# EAGLE design mke (EAGLE 5.09)
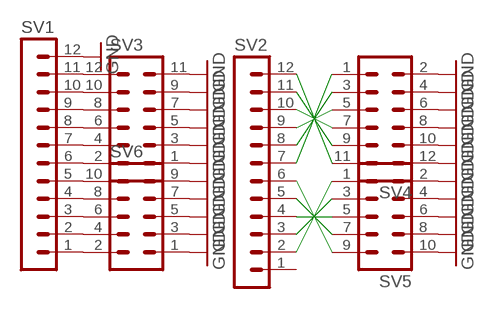
[diagram p0: schematic, sheet 1]

## Parts
SV1  MA12-1  [MA12-1]
SV2  MA12-1  [MA12-1]
SV3  MA06-2  [MA06-2]
SV4  MA06-2  [MA06-2]
SV5  MA05-2  [MA05-2]
SV6  MA05-2  [MA05-2]

## Nets
GND: SV1.12 SV3.1 SV3.3 SV3.5 SV3.7 SV3.9 SV3.11 SV4.2 SV4.4 SV4.6 SV4.8 SV4.10 SV4.12 SV5.2 SV5.4 SV5.6 SV5.8 SV5.10 SV6.1 SV6.3 SV6.5 SV6.7 SV6.9
N$1: SV1.6 SV3.2
N$2: SV1.7 SV3.4
N$3: SV1.8 SV3.6
N$4: SV1.9 SV3.8
N$5: SV1.10 SV3.10
N$6: SV1.11 SV3.12
N$7: SV2.2 SV5.1
N$8: SV2.3 SV5.3
N$9: SV2.4 SV5.5
N$10: SV2.5 SV5.7
N$11: SV2.6 SV5.9
N$12: SV2.12 SV4.11
N$13: SV1.1 SV6.2
N$14: SV1.2 SV6.4
N$15: SV1.3 SV6.6
N$16: SV1.4 SV6.8
N$17: SV1.5 SV6.10
N$18: SV2.7 SV4.1
N$19: SV2.8 SV4.3
N$20: SV2.11 SV4.9
N$21: SV2.10 SV4.7
N$22: SV2.9 SV4.5
Unconnected: SV2.1

## Library data of the parts
SV1 SV2 = con-lstb:MA12-1: PIN HEADER
SV3 SV4 = con-lstb:MA06-2: PIN HEADER
SV5 SV6 = con-lstb:MA05-2: PIN HEADER

## Board
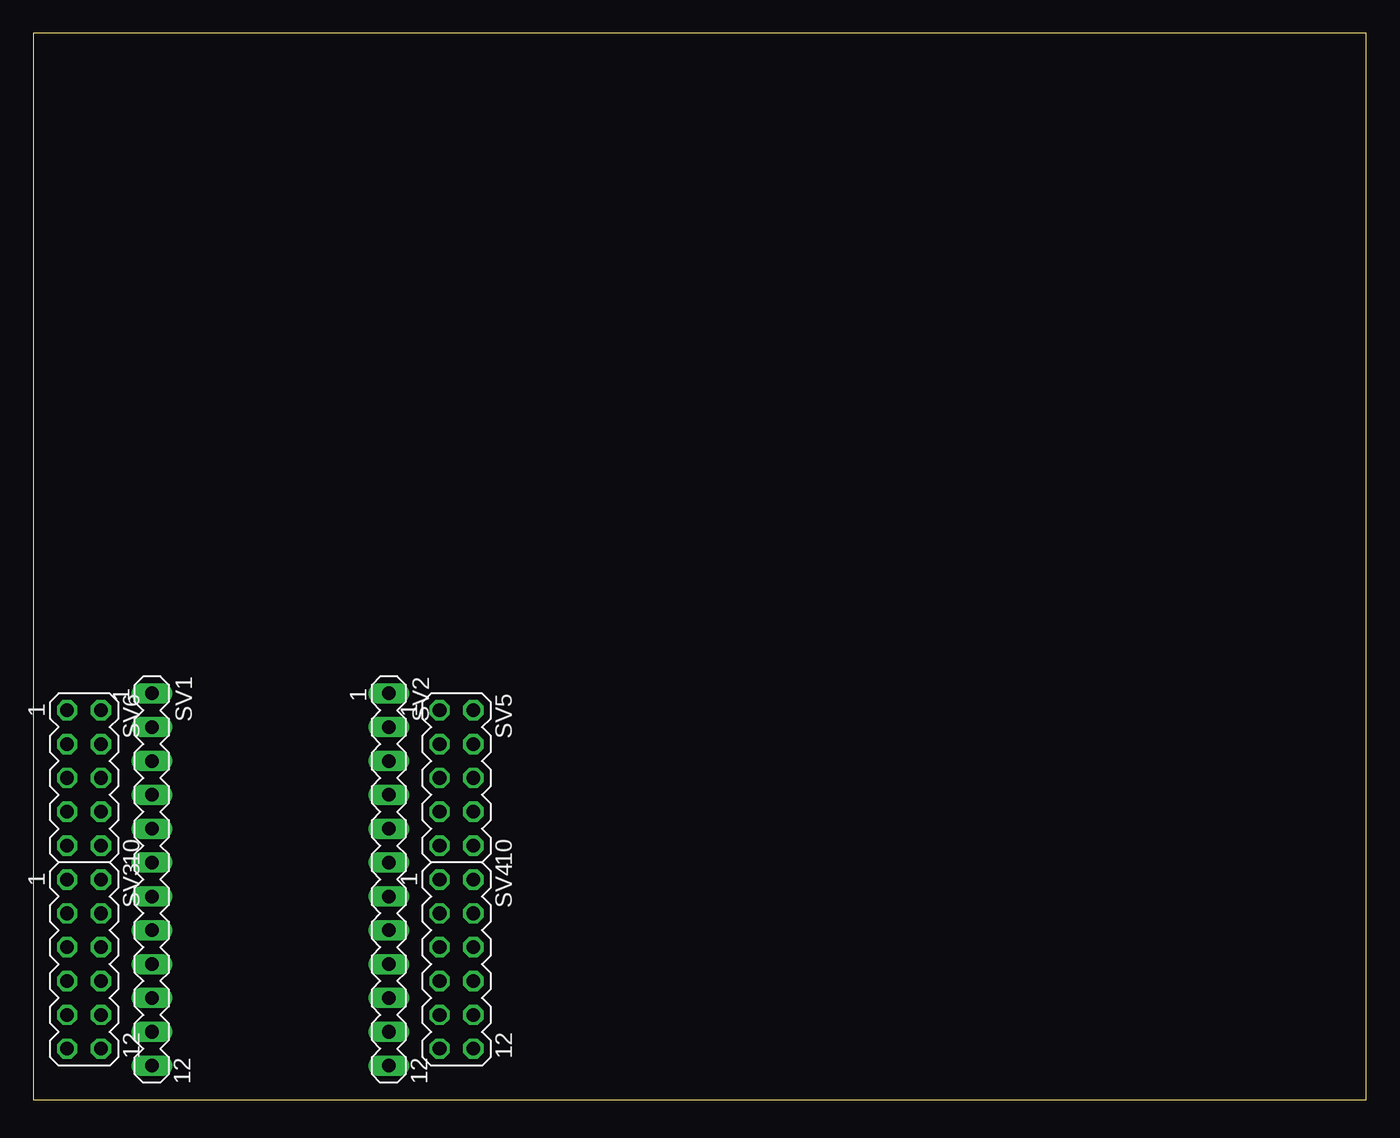
[diagram p1: board, top side]
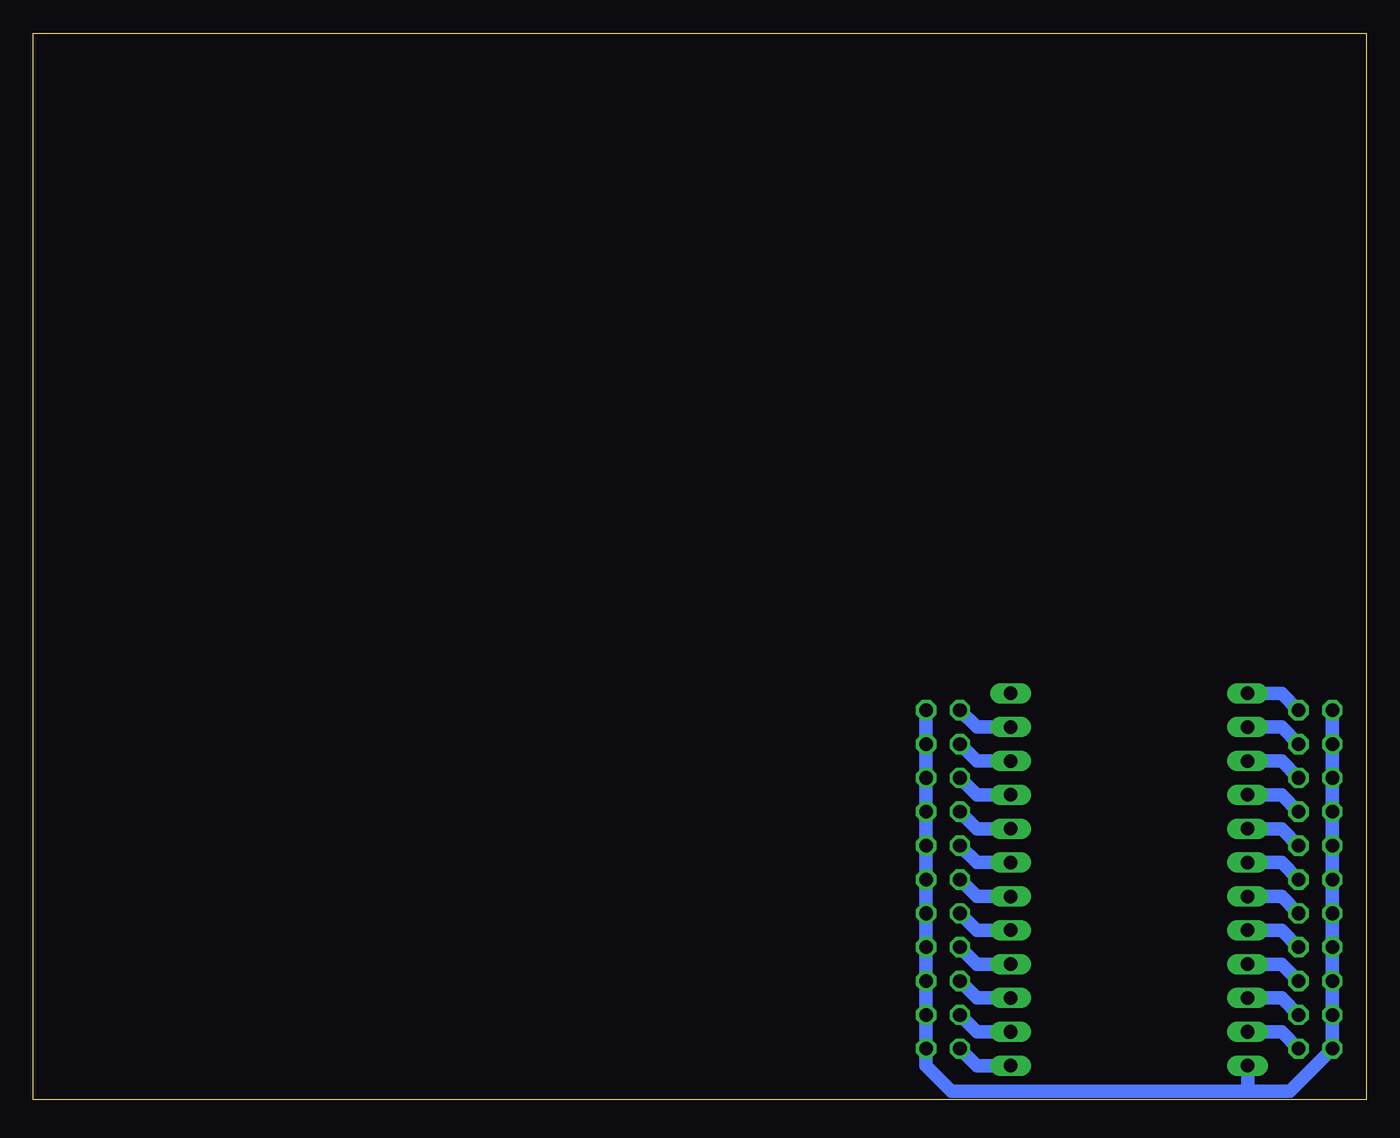
[diagram p2: board, bottom side, seen from below]

Size 100 x 80 mm. Coordinates in mm from the lower left corner, seen from the top.
Outline: 0,0 100,0 100,80 0,80 0,0
Copper layers (1*16): Top 0.035mm / dielectric 1.5mm / Bottom 0.035mm
Design rules "default": minimum track width 10mil, minimum drill 0.6mm, track to track 8mil, track to pad 8mil, pad to pad 8mil, via to via 8mil, smd to smd 8mil, copper to edge 40mil, drill to drill 8mil, minimum pad ring 10mil, minimum via ring 8mil, stop-mask expansion 4mil, vias tented up to drill 0mil, thermal gap 10mil

### Footprints (pad centres in the part's own frame; a part is rotated, then mirrored left to right if it is on the bottom)
MA12-1 = drill 1.016 long: 1 -13.97,0; 2 -11.43,0; 3 -8.89,0; 4 -6.35,0; 5 -3.81,0; 6 -1.27,0; 7 1.27,0; 8 3.81,0; 9 6.35,0; 10 8.89,0; 11 11.43,0; 12 13.97,0
MA06-2 = drill 1.016 octagon: 1 -6.35,-1.27; 2 -6.35,1.27; 3 -3.81,-1.27; 4 -3.81,1.27; 5 -1.27,-1.27; 6 -1.27,1.27; 7 1.27,-1.27; 8 1.27,1.27; 9 3.81,-1.27; 10 3.81,1.27; 11 6.35,-1.27; 12 6.35,1.27
MA05-2 = drill 1.016 octagon: 1 -5.08,-1.27; 2 -5.08,1.27; 3 -2.54,-1.27; 4 -2.54,1.27; 5 0,-1.27; 6 0,1.27; 7 2.54,-1.27; 8 2.54,1.27; 9 5.08,-1.27; 10 5.08,1.27

### Placement (x,y rotation side)
SV1  8.89,16.51 270 top
SV2  26.67,16.51 270 top
SV3  3.81,10.16 270 top
SV4  31.75,10.16 270 top
SV5  31.75,24.13 270 top
SV6  3.81,24.13 270 top

### Tracks (layer width: path | path; a pad name or v marks a point on that pad's centre or on a via)
GND
  Bottom 1.016: SV5.2 SV5.4 SV5.6 SV5.8 SV5.10 SV4.2 SV4.4 SV4.6 SV4.8 SV4.10 SV4.12 33.02,2.54 31.11,0.64 8.89,0.64 | 8.89,0.64 5.71,0.64 SV3.11 SV3.9 SV3.7 SV3.5 SV3.3 SV3.1 SV6.9 SV6.7 SV6.5 SV6.3 SV6.1 | 8.89,0.64 SV1.12
N$1
  Bottom 1.016: SV1.6 6.35,17.78 SV3.2
N$2
  Bottom 1.016: SV1.7 6.35,15.24 SV3.4
N$3
  Bottom 1.016: SV1.8 6.35,12.7 SV3.6
N$4
  Bottom 1.016: SV1.9 6.35,10.16 SV3.8
N$5
  Bottom 1.016: SV1.10 6.35,7.62 SV3.10
N$6
  Bottom 1.016: SV1.11 6.35,5.08 SV3.12
N$7
  Bottom 1.016: SV2.2 29.21,27.94 SV5.1
N$8
  Bottom 1.016: SV2.3 29.21,25.4 SV5.3
N$9
  Bottom 1.016: SV2.4 29.21,22.86 SV5.5
N$10
  Bottom 1.016: SV2.5 29.21,20.32 SV5.7
N$11
  Bottom 1.016: SV2.6 29.21,17.78 SV5.9
N$12
  Bottom 1.016: SV2.12 29.21,2.54 SV4.11
N$13
  Bottom 1.016: SV1.1 6.35,30.48 SV6.2
N$14
  Bottom 1.016: SV1.2 6.35,27.94 SV6.4
N$15
  Bottom 1.016: SV1.3 6.35,25.4 SV6.6
N$16
  Bottom 1.016: SV1.4 6.35,22.86 SV6.8
N$17
  Bottom 1.016: SV1.5 6.35,20.32 SV6.10
N$18
  Bottom 1.016: SV2.7 29.21,15.24 SV4.1
N$19
  Bottom 1.016: SV2.8 29.21,12.7 SV4.3
N$20
  Bottom 1.016: SV2.11 29.21,5.08 SV4.9
N$21
  Bottom 1.016: SV2.10 29.21,7.62 SV4.7
N$22
  Bottom 1.016: SV2.9 29.21,10.16 SV4.5